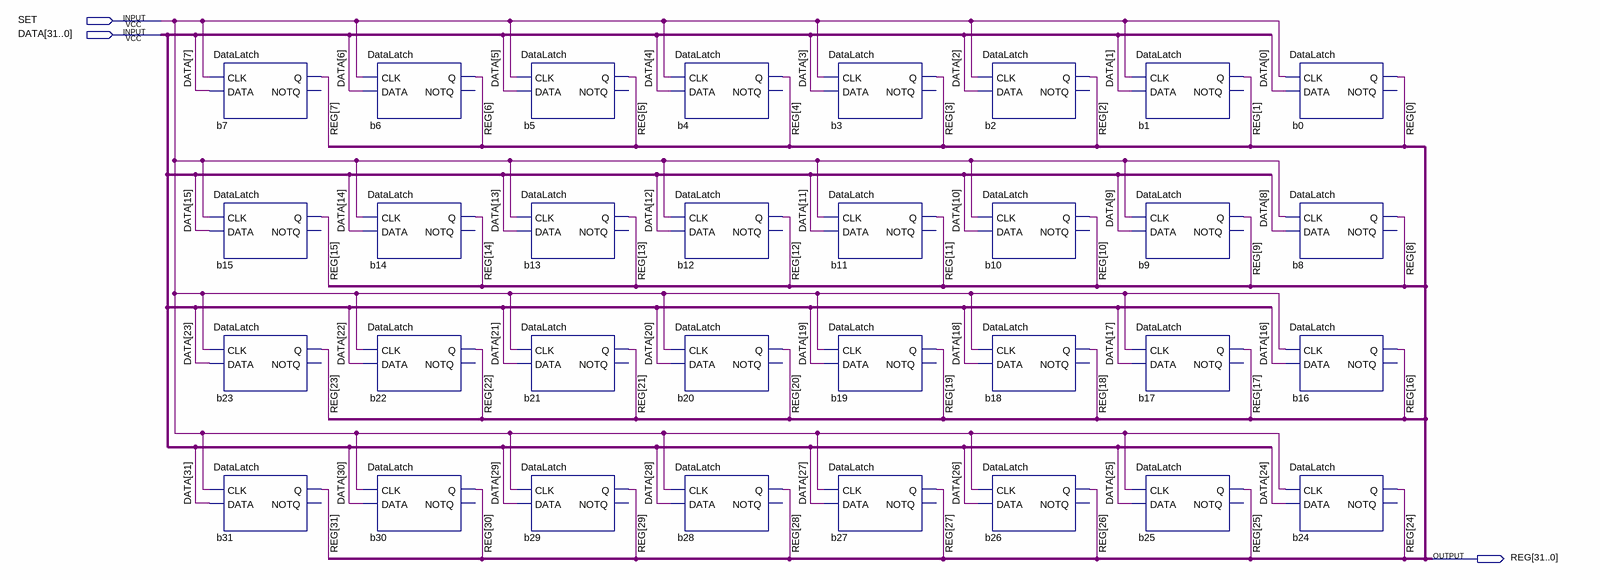
[diagram p0: schematic sheet]
// Quartus schematic Reg32.bdf as structural Verilog: 32 symbols, 3 pins
module Reg32 (
  input  SET,
  input  [31:0] DATA,
  output [31:0] REG
);

  DataLatch b7 (.CLK(SET), .DATA(DATA[7]), .Q(REG[7]));  // open: NOTQ
  DataLatch b15 (.CLK(SET), .DATA(DATA[15]), .Q(REG[15]));  // open: NOTQ
  DataLatch b23 (.CLK(SET), .DATA(DATA[23]), .Q(REG[23]));  // open: NOTQ
  DataLatch b31 (.CLK(SET), .DATA(DATA[31]), .Q(REG[31]));  // open: NOTQ
  DataLatch b6 (.CLK(SET), .DATA(DATA[6]), .Q(REG[6]));  // open: NOTQ
  DataLatch b14 (.CLK(SET), .DATA(DATA[14]), .Q(REG[14]));  // open: NOTQ
  DataLatch b22 (.CLK(SET), .DATA(DATA[22]), .Q(REG[22]));  // open: NOTQ
  DataLatch b30 (.CLK(SET), .DATA(DATA[30]), .Q(REG[30]));  // open: NOTQ
  DataLatch b5 (.CLK(SET), .DATA(DATA[5]), .Q(REG[5]));  // open: NOTQ
  DataLatch b13 (.CLK(SET), .DATA(DATA[13]), .Q(REG[13]));  // open: NOTQ
  DataLatch b21 (.CLK(SET), .DATA(DATA[21]), .Q(REG[21]));  // open: NOTQ
  DataLatch b29 (.CLK(SET), .DATA(DATA[29]), .Q(REG[29]));  // open: NOTQ
  DataLatch b4 (.CLK(SET), .DATA(DATA[4]), .Q(REG[4]));  // open: NOTQ
  DataLatch b12 (.CLK(SET), .DATA(DATA[12]), .Q(REG[12]));  // open: NOTQ
  DataLatch b20 (.CLK(SET), .DATA(DATA[20]), .Q(REG[20]));  // open: NOTQ
  DataLatch b28 (.CLK(SET), .DATA(DATA[28]), .Q(REG[28]));  // open: NOTQ
  DataLatch b3 (.CLK(SET), .DATA(DATA[3]), .Q(REG[3]));  // open: NOTQ
  DataLatch b11 (.CLK(SET), .DATA(DATA[11]), .Q(REG[11]));  // open: NOTQ
  DataLatch b19 (.CLK(SET), .DATA(DATA[19]), .Q(REG[19]));  // open: NOTQ
  DataLatch b27 (.CLK(SET), .DATA(DATA[27]), .Q(REG[27]));  // open: NOTQ
  DataLatch b2 (.CLK(SET), .DATA(DATA[2]), .Q(REG[2]));  // open: NOTQ
  DataLatch b10 (.CLK(SET), .DATA(DATA[10]), .Q(REG[10]));  // open: NOTQ
  DataLatch b18 (.CLK(SET), .DATA(DATA[18]), .Q(REG[18]));  // open: NOTQ
  DataLatch b26 (.CLK(SET), .DATA(DATA[26]), .Q(REG[26]));  // open: NOTQ
  DataLatch b1 (.CLK(SET), .DATA(DATA[1]), .Q(REG[1]));  // open: NOTQ
  DataLatch b9 (.CLK(SET), .DATA(DATA[9]), .Q(REG[9]));  // open: NOTQ
  DataLatch b17 (.CLK(SET), .DATA(DATA[17]), .Q(REG[17]));  // open: NOTQ
  DataLatch b25 (.CLK(SET), .DATA(DATA[25]), .Q(REG[25]));  // open: NOTQ
  DataLatch b0 (.CLK(SET), .DATA(DATA[0]), .Q(REG[0]));  // open: NOTQ
  DataLatch b8 (.CLK(SET), .DATA(DATA[8]), .Q(REG[8]));  // open: NOTQ
  DataLatch b16 (.CLK(SET), .DATA(DATA[16]), .Q(REG[16]));  // open: NOTQ
  DataLatch b24 (.CLK(SET), .DATA(DATA[24]), .Q(REG[24]));  // open: NOTQ
endmodule
